# Altium schematic sheet Sitara_AUX.SchDoc
size A3; SheetNumber: 5; SheetTotal: 11
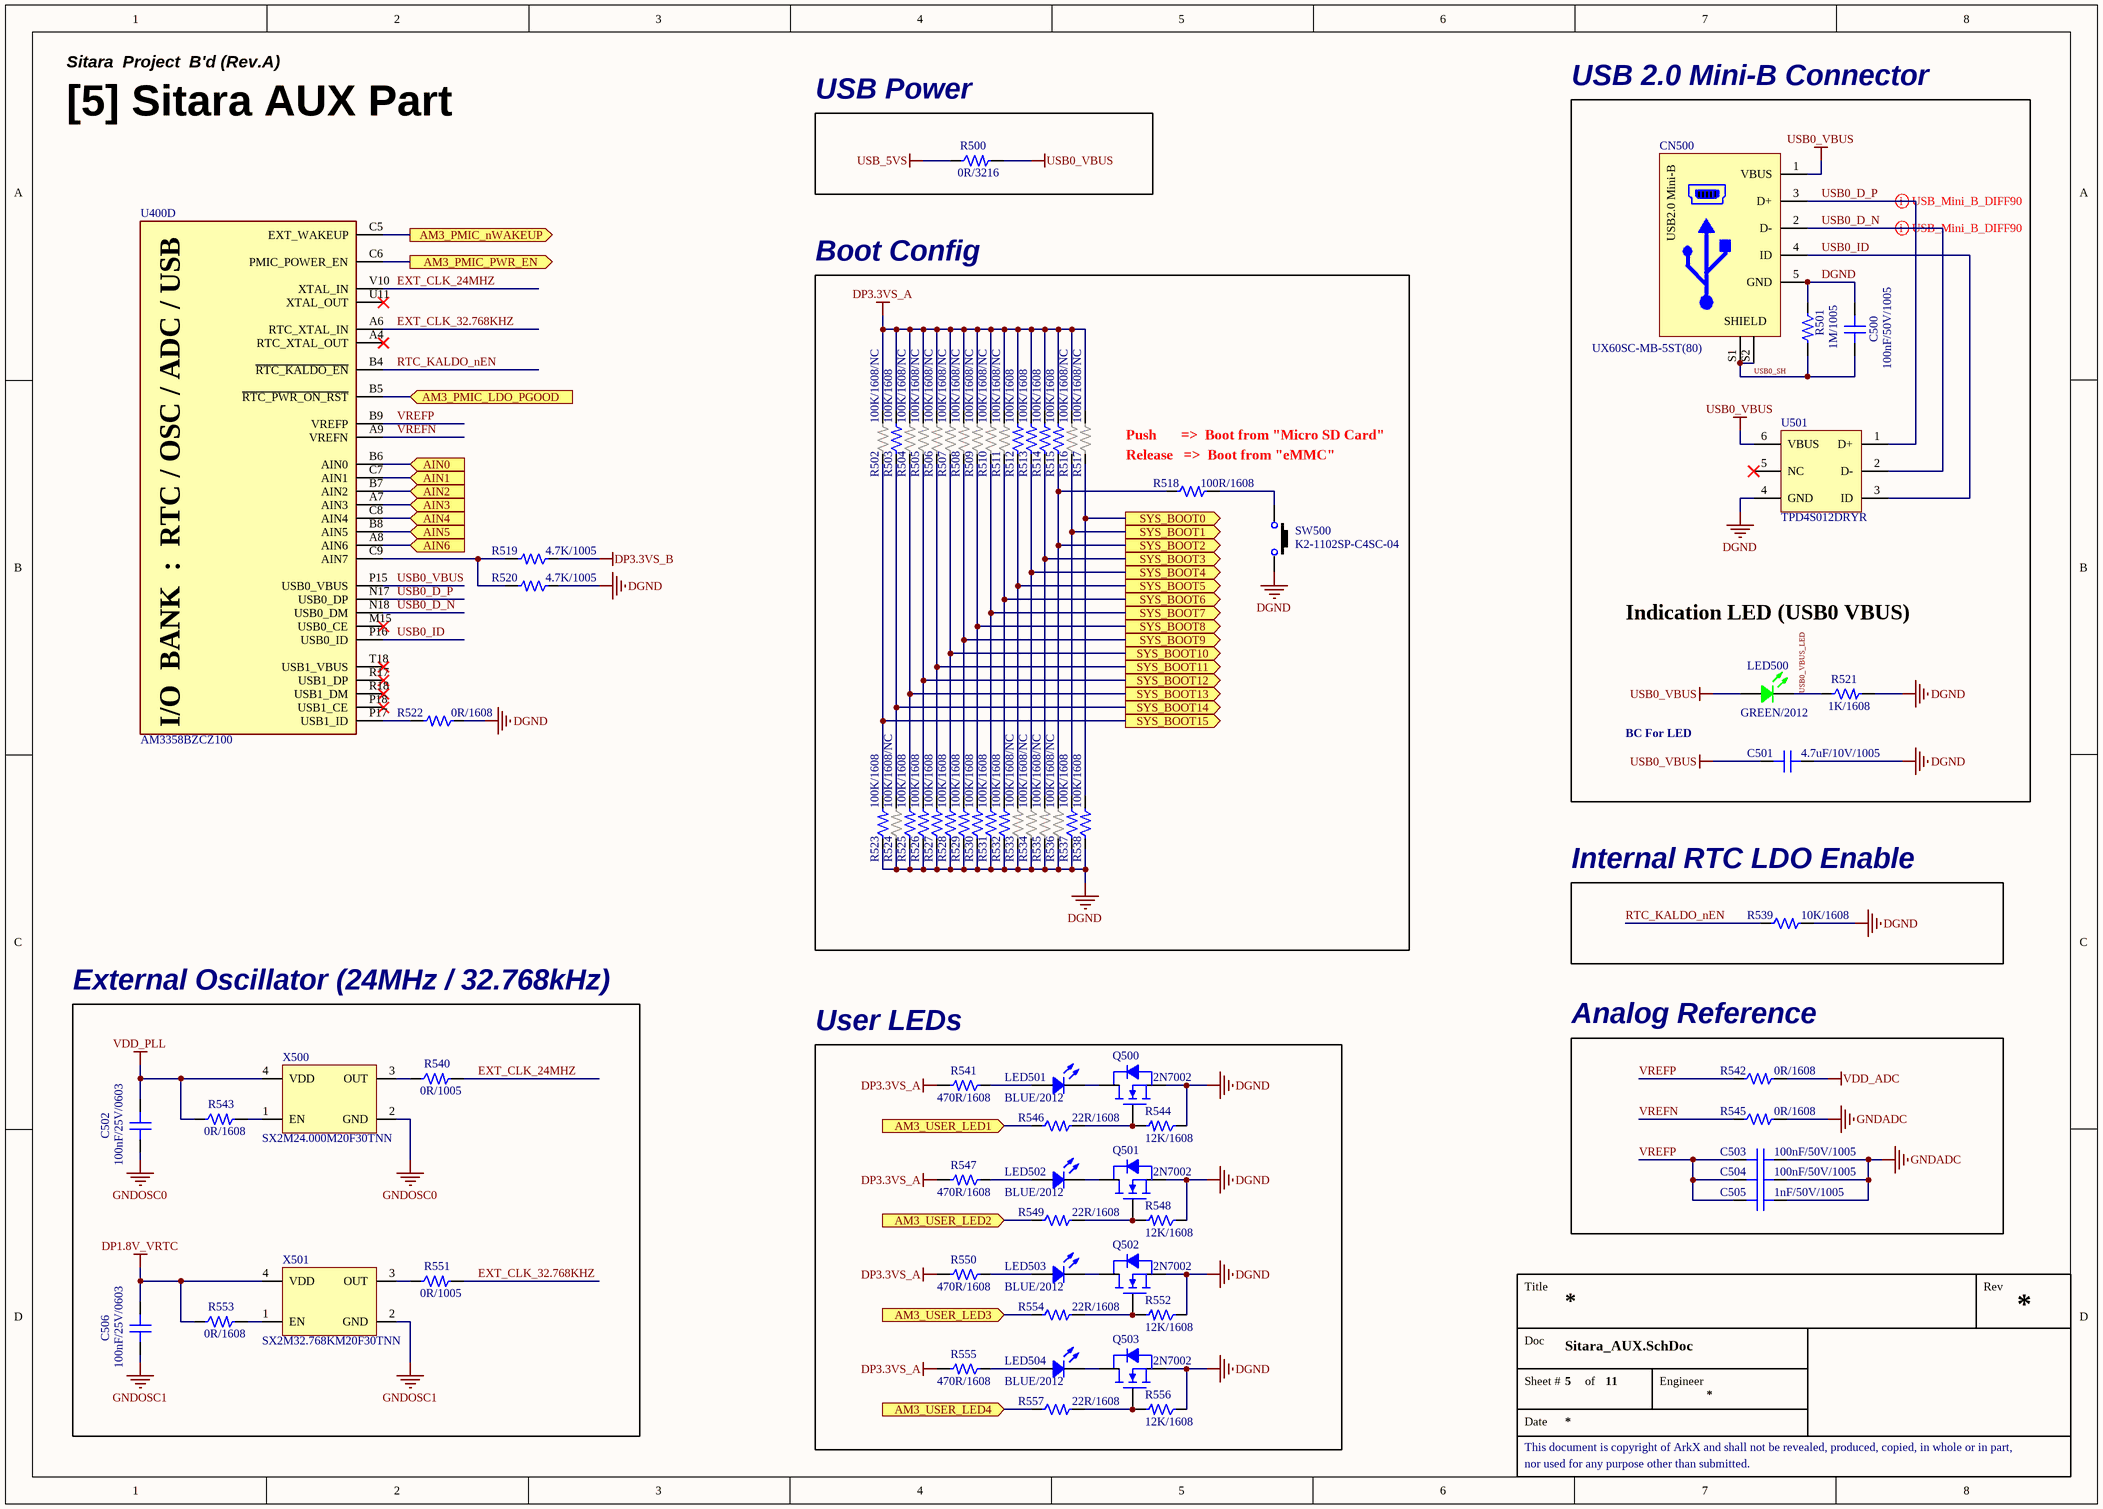
[diagram p0: Sitara_AUX.SchDoc]

## Parts
C500  100nF/50V/1005  [CAP 1005 (0402_INCH)]
C501  4.7uF/10V/1005  [CAP 1005 (0402_INCH)]
C502  100nF/25V/0603  [CAP 0603 (0201_INCH)]
C503  100nF/50V/1005  [CAP 1005 (0402_INCH)]
C504  100nF/50V/1005  [CAP 1005 (0402_INCH)]
C505  1nF/50V/1005  [CAP 1005 (0402_INCH)]
C506  100nF/25V/0603  [CAP 0603 (0201_INCH)]
CN500  UX60SC-MB-5ST(80)  [CON_USB2.0-Mini-B (UX60SC-MB-5ST(80))]
LED500  GREEN/2012  [LED MHT170RGBCT (GREEN)]
LED501  BLUE/2012  [LED MHT170RGBCT (BLUE)]
LED502  BLUE/2012  [LED MHT170RGBCT (BLUE)]
LED503  BLUE/2012  [LED MHT170RGBCT (BLUE)]
LED504  BLUE/2012  [LED MHT170RGBCT (BLUE)]
Q500  2N7002  [SOT 23-3 (DIODES INCORPORATED)]
Q501  2N7002  [SOT 23-3 (DIODES INCORPORATED)]
Q502  2N7002  [SOT 23-3 (DIODES INCORPORATED)]
Q503  2N7002  [SOT 23-3 (DIODES INCORPORATED)]
R500  0R/3216  [RES 3216 (1206_inch)]
R501  1M/1005  [RES 1005 (0402_inch)]
R502  100K/1608/NC  [RES 1608 (0603_inch)/NC]
R503  100K/1608  [RES 1608 (0603_inch)]
R504  100K/1608/NC  [RES 1608 (0603_inch)/NC]
R505  100K/1608/NC  [RES 1608 (0603_inch)/NC]
R506  100K/1608/NC  [RES 1608 (0603_inch)/NC]
R507  100K/1608/NC  [RES 1608 (0603_inch)/NC]
R508  100K/1608/NC  [RES 1608 (0603_inch)/NC]
R509  100K/1608/NC  [RES 1608 (0603_inch)/NC]
R510  100K/1608/NC  [RES 1608 (0603_inch)/NC]
R511  100K/1608/NC  [RES 1608 (0603_inch)/NC]
R512  100K/1608  [RES 1608 (0603_inch)]
R513  100K/1608  [RES 1608 (0603_inch)]
R514  100K/1608  [RES 1608 (0603_inch)]
R515  100K/1608  [RES 1608 (0603_inch)]
R516  100K/1608/NC  [RES 1608 (0603_inch)/NC]
R517  100K/1608/NC  [RES 1608 (0603_inch)/NC]
R518  100R/1608  [RES 1608 (0603_inch)]
R519  4.7K/1005  [RES 1005 (0402_inch)]
R520  4.7K/1005  [RES 1005 (0402_inch)]
R521  1K/1608  [RES 1608 (0603_inch)]
R522  0R/1608  [RES 1608 (0603_inch)]
R523  100K/1608  [RES 1608 (0603_inch)]
R524  100K/1608/NC  [RES 1608 (0603_inch)/NC]
R525  100K/1608  [RES 1608 (0603_inch)]
R526  100K/1608  [RES 1608 (0603_inch)]
R527  100K/1608  [RES 1608 (0603_inch)]
R528  100K/1608  [RES 1608 (0603_inch)]
R529  100K/1608  [RES 1608 (0603_inch)]
R530  100K/1608  [RES 1608 (0603_inch)]
R531  100K/1608  [RES 1608 (0603_inch)]
R532  100K/1608  [RES 1608 (0603_inch)]
R533  100K/1608/NC  [RES 1608 (0603_inch)/NC]
R534  100K/1608/NC  [RES 1608 (0603_inch)/NC]
R535  100K/1608/NC  [RES 1608 (0603_inch)/NC]
R536  100K/1608/NC  [RES 1608 (0603_inch)/NC]
R537  100K/1608  [RES 1608 (0603_inch)]
R538  100K/1608  [RES 1608 (0603_inch)]
R539  10K/1608  [RES 1608 (0603_inch)]
R540  0R/1005  [RES 1005 (0402_inch)]
R541  470R/1608  [RES 1608 (0603_inch)]
R542  0R/1608  [RES 1608 (0603_inch)]
R543  0R/1608  [RES 1608 (0603_inch)]
R544  12K/1608  [RES 1608 (0603_inch)]
R545  0R/1608  [RES 1608 (0603_inch)]
R546  22R/1608  [RES 1608 (0603_inch)]
R547  470R/1608  [RES 1608 (0603_inch)]
R548  12K/1608  [RES 1608 (0603_inch)]
R549  22R/1608  [RES 1608 (0603_inch)]
R550  470R/1608  [RES 1608 (0603_inch)]
R551  0R/1005  [RES 1005 (0402_inch)]
R552  12K/1608  [RES 1608 (0603_inch)]
R553  0R/1608  [RES 1608 (0603_inch)]
R554  22R/1608  [RES 1608 (0603_inch)]
R555  470R/1608  [RES 1608 (0603_inch)]
R556  12K/1608  [RES 1608 (0603_inch)]
R557  22R/1608  [RES 1608 (0603_inch)]
SW500  K2-1102SP-C4SC-04  [SW K2-1102SP-C4SC-04]
U400  AM3358BZCZ100  [IC_SOC_AM3358BZCZ100]  (part D of 8)
U501  TPD4S012DRYR  [IC_SON-6]
X500  SX2M24.000M20F30TNN  [OSC SMD_2.5x2.0 (SCTF)]
X501  SX2M32.768KM20F30TNN  [OSC SMD_2.5x2.0 (SCTF)]

## Blocks framed on the sheet
USB Power: R500
USB 2.0 Mini-B Connector: C500 C501 CN500 LED500 R501 R521 U501
Boot Config: R502-R518 R523-R538 SW500
Internal RTC LDO Enable: R539
External Oscillator (24MHz / 32.768kHz): C502 C506 R540 R543 R551 R553 X500 X501
Analog Reference: C503-C505 R542 R545
User LEDs: LED501-LED504 Q500-Q503 R541 R544 R546-R550 R552 R554-R557

## Ports
AIN0 (in), AIN1 (in), AIN2 (in), AIN3 (in), AIN4 (in), AIN5 (in), AIN6 (in), AM3_PMIC_LDO_PGOOD (in), AM3_PMIC_nWAKEUP (out), AM3_PMIC_PWR_EN (out), AM3_USER_LED1 (in), AM3_USER_LED2 (in), AM3_USER_LED3 (in), AM3_USER_LED4 (in), SYS_BOOT0 (out), SYS_BOOT1 (out), SYS_BOOT2 (out), SYS_BOOT3 (out), SYS_BOOT4 (out), SYS_BOOT5 (out), SYS_BOOT6 (out), SYS_BOOT7 (out), SYS_BOOT8 (out), SYS_BOOT9 (out), SYS_BOOT10 (out), SYS_BOOT11 (out), SYS_BOOT12 (out), SYS_BOOT13 (out), SYS_BOOT14 (out), SYS_BOOT15 (out)

## Nets
DGND: C500.2 C501.1 CN500.5(GND) Q500.2(S) Q501.2(S) Q502.2(S) Q503.2(S) R501.1 R520.1 R521.2 R522.1 R523.1 R524.1 R525.1 R526.1 R527.1 R528.1 R529.1 R530.1 R531.1 R532.1 R533.1 R534.1 R535.1 R536.1 R537.1 R538.1 R539.2 R544.1 R548.1 R552.1 R556.1 SW500.3 U501.4(GND)
DP1.8V_VRTC: C506.2 R553.1 X501.4(VDD)
DP3.3VS_A: R502.2 R503.2 R504.2 R505.2 R506.2 R507.2 R508.2 R509.2 R510.2 R511.2 R512.2 R513.2 R514.2 R515.2 R516.2 R517.2 R541.2 R547.2 R550.2 R555.2
DP3.3VS_B: R519.1
GNDADC: C503.2 C504.2 C505.1 R545.2
GNDOSC0: C502.1 X500.2(GND)
GNDOSC1: C506.1 X501.2(GND)
USB0_VBUS: C501.2 CN500.1(VBUS) LED500.4(Common_Anode) R500.2 U400.P15(USB0_VBUS) U501.6(VBUS)
USB_5VS: R500.1
VDD_ADC: R542.2
VDD_PLL: C502.2 R543.1 X500.4(VDD)
AIN0: U400.B6(AIN0) ; port AIN0
AIN1: U400.C7(AIN1) ; port AIN1
AIN2: U400.B7(AIN2) ; port AIN2
AIN3: U400.A7(AIN3) ; port AIN3
AIN4: U400.C8(AIN4) ; port AIN4
AIN5: U400.B8(AIN5) ; port AIN5
AIN6: U400.A8(AIN6) ; port AIN6
AM3_PMIC_LDO_PGOOD: U400.B5(~{RTC_PWR_ON_RST}) ; port AM3_PMIC_LDO_PGOOD
AM3_PMIC_nWAKEUP: U400.C5(EXT_WAKEUP) ; port AM3_PMIC_nWAKEUP
AM3_PMIC_PWR_EN: U400.C6(PMIC_POWER_EN) ; port AM3_PMIC_PWR_EN
AM3_USER_LED1: R546.1 ; port AM3_USER_LED1
AM3_USER_LED2: R549.1 ; port AM3_USER_LED2
AM3_USER_LED3: R554.1 ; port AM3_USER_LED3
AM3_USER_LED4: R557.1 ; port AM3_USER_LED4
EXT_CLK_24MHZ: R540.2 U400.V10(XTAL_IN)
EXT_CLK_32.768KHZ: R551.2 U400.A6(RTC_XTAL_IN)
RTC_KALDO_nEN: R539.1 U400.B4(~{RTC_KALDO_EN})
SYS_BOOT0: R517.1 R538.2 ; port SYS_BOOT0
SYS_BOOT1: R516.1 R537.2 ; port SYS_BOOT1
SYS_BOOT2: R515.1 R518.1 R536.2 ; port SYS_BOOT2
SYS_BOOT3: R514.1 R535.2 ; port SYS_BOOT3
SYS_BOOT4: R513.1 R534.2 ; port SYS_BOOT4
SYS_BOOT5: R512.1 R533.2 ; port SYS_BOOT5
SYS_BOOT6: R511.1 R532.2 ; port SYS_BOOT6
SYS_BOOT7: R510.1 R531.2 ; port SYS_BOOT7
SYS_BOOT8: R509.1 R530.2 ; port SYS_BOOT8
SYS_BOOT9: R508.1 R529.2 ; port SYS_BOOT9
SYS_BOOT10: R507.1 R528.2 ; port SYS_BOOT10
SYS_BOOT11: R506.1 R527.2 ; port SYS_BOOT11
SYS_BOOT12: R505.1 R526.2 ; port SYS_BOOT12
SYS_BOOT13: R504.1 R525.2 ; port SYS_BOOT13
SYS_BOOT14: R503.1 R524.2 ; port SYS_BOOT14
SYS_BOOT15: R502.1 R523.2 ; port SYS_BOOT15
USB0_D_N: CN500.2(D-) U400.N18(USB0_DM) U501.2(D-)
USB0_D_P: CN500.3(D+) U400.N17(USB0_DP) U501.1(D+)
USB0_ID: CN500.4(ID) U400.P16(USB0_ID) U501.3(ID)
USB0_SH: C500.1 CN500.S1(SHIELD) CN500.S2(SHIELD) R501.2
USB0_VBUS_LED: LED500.2(GREEN) R521.1
VREFN: R545.1 U400.A9(VREFN)
VREFP: C503.1 C504.1 C505.2 R542.1 U400.B9(VREFP)
NetLED501_3: LED501.3(BLUE) Q500.3(D)
NetLED501_4: LED501.4(Common_Anode) R541.1
NetLED502_3: LED502.3(BLUE) Q501.3(D)
NetLED502_4: LED502.4(Common_Anode) R547.1
NetLED503_3: LED503.3(BLUE) Q502.3(D)
NetLED503_4: LED503.4(Common_Anode) R550.1
NetLED504_3: LED504.3(BLUE) Q503.3(D)
NetLED504_4: LED504.4(Common_Anode) R555.1
NetQ500_1: Q500.1(G) R544.2 R546.2
NetQ501_1: Q501.1(G) R548.2 R549.2
NetQ502_1: Q502.1(G) R552.2 R554.2
NetQ503_1: Q503.1(G) R556.2 R557.2
NetR518_2: R518.2 SW500.1
NetR519_2: R519.2 R520.2 U400.C9(AIN7)
NetR522_2: R522.2 U400.P17(USB1_ID)
NetR540_1: R540.1 X500.3(OUT)
NetR543_2: R543.2 X500.1(EN)
NetR551_1: R551.1 X501.3(OUT)
NetR553_2: R553.2 X501.1(EN)

Not connected (* = marked no-connect by the designer): U400 A4(RTC_XTAL_OUT)* M15(USB0_CE)* P18(USB1_CE)* R17(USB1_DP)* R18(USB1_DM)* T18(USB1_VBUS)* U11(XTAL_OUT)*; U501 5(NC)*

## Layout directives
differential pair; differential pair class USB_Mini_B_DIFF90: USB0_D_N, USB0_D_P

## Notes on the sheet
- Sitara  Project  B'd (Rev.A)
- [5] Sitara AUX Part
- Push       =>  Boot from "Micro SD Card"
- Release   =>  Boot from "eMMC"
- Indication LED (USB0 VBUS)
- BC For LED
- Title
- Rev
- Doc
- Sheet #
- of
- Engineer
- This document is copyright of ArkX and shall not be revealed, produced, copied, in whole or in part,
- Date
- nor used for any purpose other than submitted.
- (in symbol CON_USB2.0-Mini-B) USB2.0 Mini-B
- (in symbol IC_SOC_AM3358BZCZ100, part D) I/O  BANK  :  RTC / OSC / ADC / USB

## Library data of the parts
C500 C503 C504 = CAP_100nF/50V/1005: Ceramic CAP_100nF/50V/1005; LCSC Part #: C307331; JLCPCB Part Type: Basic Part
C501 = CAP_4.7uF/10V/1005: 10V 4.7uF X5R ±20% 0402  Multilayer Ceramic Capacitors MLCC - SMD/SMT ROHS; JLCPCB Part Type: Basic Part; LCSC Part #: C23733
C502 C506 = CAP_100nF/25V/0603: Ceramic CAP_100nF/25V/0603; JLCPCB Part Type: Extended Part; LCSC Part #: C181047
C505 = CAP_1nF/50V/1005: Ceramic CAP_1nF/50V/1005; LCSC Part #: C1523; JLCPCB Part Type: Basic Part
CN500 = CON_USB2.0-Mini-B: USB - mini B USB 2.0 Receptacle Connector 5 Position Surface Mount, Right Angle; LCSC Part #: C2692070; JLCPCB Part Type: Extended Part
LED500 = LED_MHT170RGBCT(GREEN): Colorless transparence -30℃~+85℃ Positive post Common anode RGB 120° 0805  Light Emitting Diodes (LED) ROHS; LCSC Part #: C2962094; JLCPCB Part Type: Extended Part
LED501-LED504 = LED_MHT170RGBCT(BLUE): Colorless transparence -30℃~+85℃ Positive post Common anode RGB 120° 0805  Light Emitting Diodes (LED) ROHS; LCSC Part #: C2962094; JLCPCB Part Type: Extended Part
Q500-Q503 = FET_2N7002: 60V 115mA 200mW 7.5Ω@10V,500mA N Channel SOT-23  MOSFETs ROHS; LCSC Part #: C8545; JLCPCB Part Type: Basic Part
R500 = RES_0R/3216/0.25W: Power Rating: 0.1W; Precision: 1%; Size: 1608; LCSC Part #: C17888; JLCPCB Part Type: Basic Part
R501 = RES_1M/1005/62.5mW: Value: 1M; Power Rating: 62.5mW; Precision: 1%; Size: 1005; LCSC Part #: C26083; JLCPCB Part Type: Basic Part
R502 R504-R511 R516 R517 R524 R533-R536 = RES_NC_100K/1608/0.1W: RES_100K/1608/0.1W; Value: 100K; Power Rating: 0.1W; Precision: 1%; Size: 1608
R503 R512-R515 R523 R525-R532 R537 R538 = RES_100K/1608/0.1W: Value: 100K; Power Rating: 0.1W; Precision: 1%; Size: 1608; LCSC Part #: C25803; JLCPCB Part Type: Basic Part
R518 = RES_100R/1608/0.1W: Value: 100R; Power Rating: 0.1W; Precision: 1%; Size: 1608; LCSC Part #: C22775; JLCPCB Part Type: Basic Part
R519 R520 = RES_4.7K/1005/62.5mW: Value: 4.7K; Power Rating: 62.5mW; Precision: 1%; Size: 1005; LCSC Part #: C25900; JLCPCB Part Type: Basic Part
R521 = RES_1K/1608/0.1W: Value: 1K; Power Rating: 0.1W; Precision: 1%; Size: 1608; LCSC Part #: C21190; JLCPCB Part Type: Basic Part
R522 R542 R543 R545 R553 = RES_0R/1608/0.1W: Value: 0R; Power Rating: 0.1W; Precision: 1%; Size: 1608; LCSC Part #: C21189; JLCPCB Part Type: Basic Part
R539 = RES_10K/1608/0.1W: Value: 10K; Power Rating: 0.1W; Precision: 1%; Size: 1608; LCSC Part #: C25804; JLCPCB Part Type: Basic Part
R540 R551 = RES_0R/1005/62.5mW: Value: 0R; Power Rating: 62.5mW; Precision: 1%; Size: 1005; LCSC Part #: C17168; JLCPCB Part Type: Basic Part
R541 R547 R550 R555 = RES_470R/1608/0.1W: Value: 470R; Power Rating: 0.1W; Precision: 1%; Size: 1608; LCSC Part #: C23179; JLCPCB Part Type: Basic Part
R544 R548 R552 R556 = RES_12K/1608/0.1W: Value: 12K; Power Rating: 0.1W; Precision: 1%; Size: 1608; LCSC Part #: C22790; JLCPCB Part Type: Basic Part
R546 R549 R554 R557 = RES_22R/1608/0.1W: Value: 22R; Power Rating: 0.1W; Precision: 1%; Size: 1608; LCSC Part #: C23345; JLCPCB Part Type: Basic Part
SW500 = SW_K2-1102SP-C4SC-04(2P): -25℃~+85℃ 6mm 5mm Round Button 50mA Brick nogging 6mm SPST 100MΩ 100000 250gf@±30gf 12V SMD  Tactile Switches ROHS; LCSC Part #: C127509; JLCPCB Part Type: Extended Part
U400 = IC_SOC_AM3358BZCZ100: ARM® Cortex®-A8 Microprocessor IC Sitara™ 1 Core, 32-Bit 1.0GHz 324-NFBGA (15x15); LCSC Part #: C73932; JLCPCB Part Type: Extended Part
U501 = DIO_TVS_TPD4S012DRYR: Clamp 3A (8/20µs) Ipp Tvs Diode Surface Mount 6-SON (1.45x1); LCSC Part #: C96506; JLCPCB Part Type: Extended Part
X500 = OSC_SX2M24.000M20F30TNN(24MHz): 1.62V~3.63V ±20ppm 10mA ±30ppm CMOS 24MHz SMD2520-4P  Crystal Oscillators ROHS; LCSC Part #: C2901600; JLCPCB Part Type: Extended Part
X501 = OSC_SX2M32.768KM20F30TNN(32.768kHz): 1.62V~3.63V ±20ppm 90uA ±30ppm CMOS 32.768kHz SMD2520-4P  Crystal Oscillators ROHS; LCSC Part #: C2901603; JLCPCB Part Type: Extended Part